# Altium project AD9910.PrjPcb
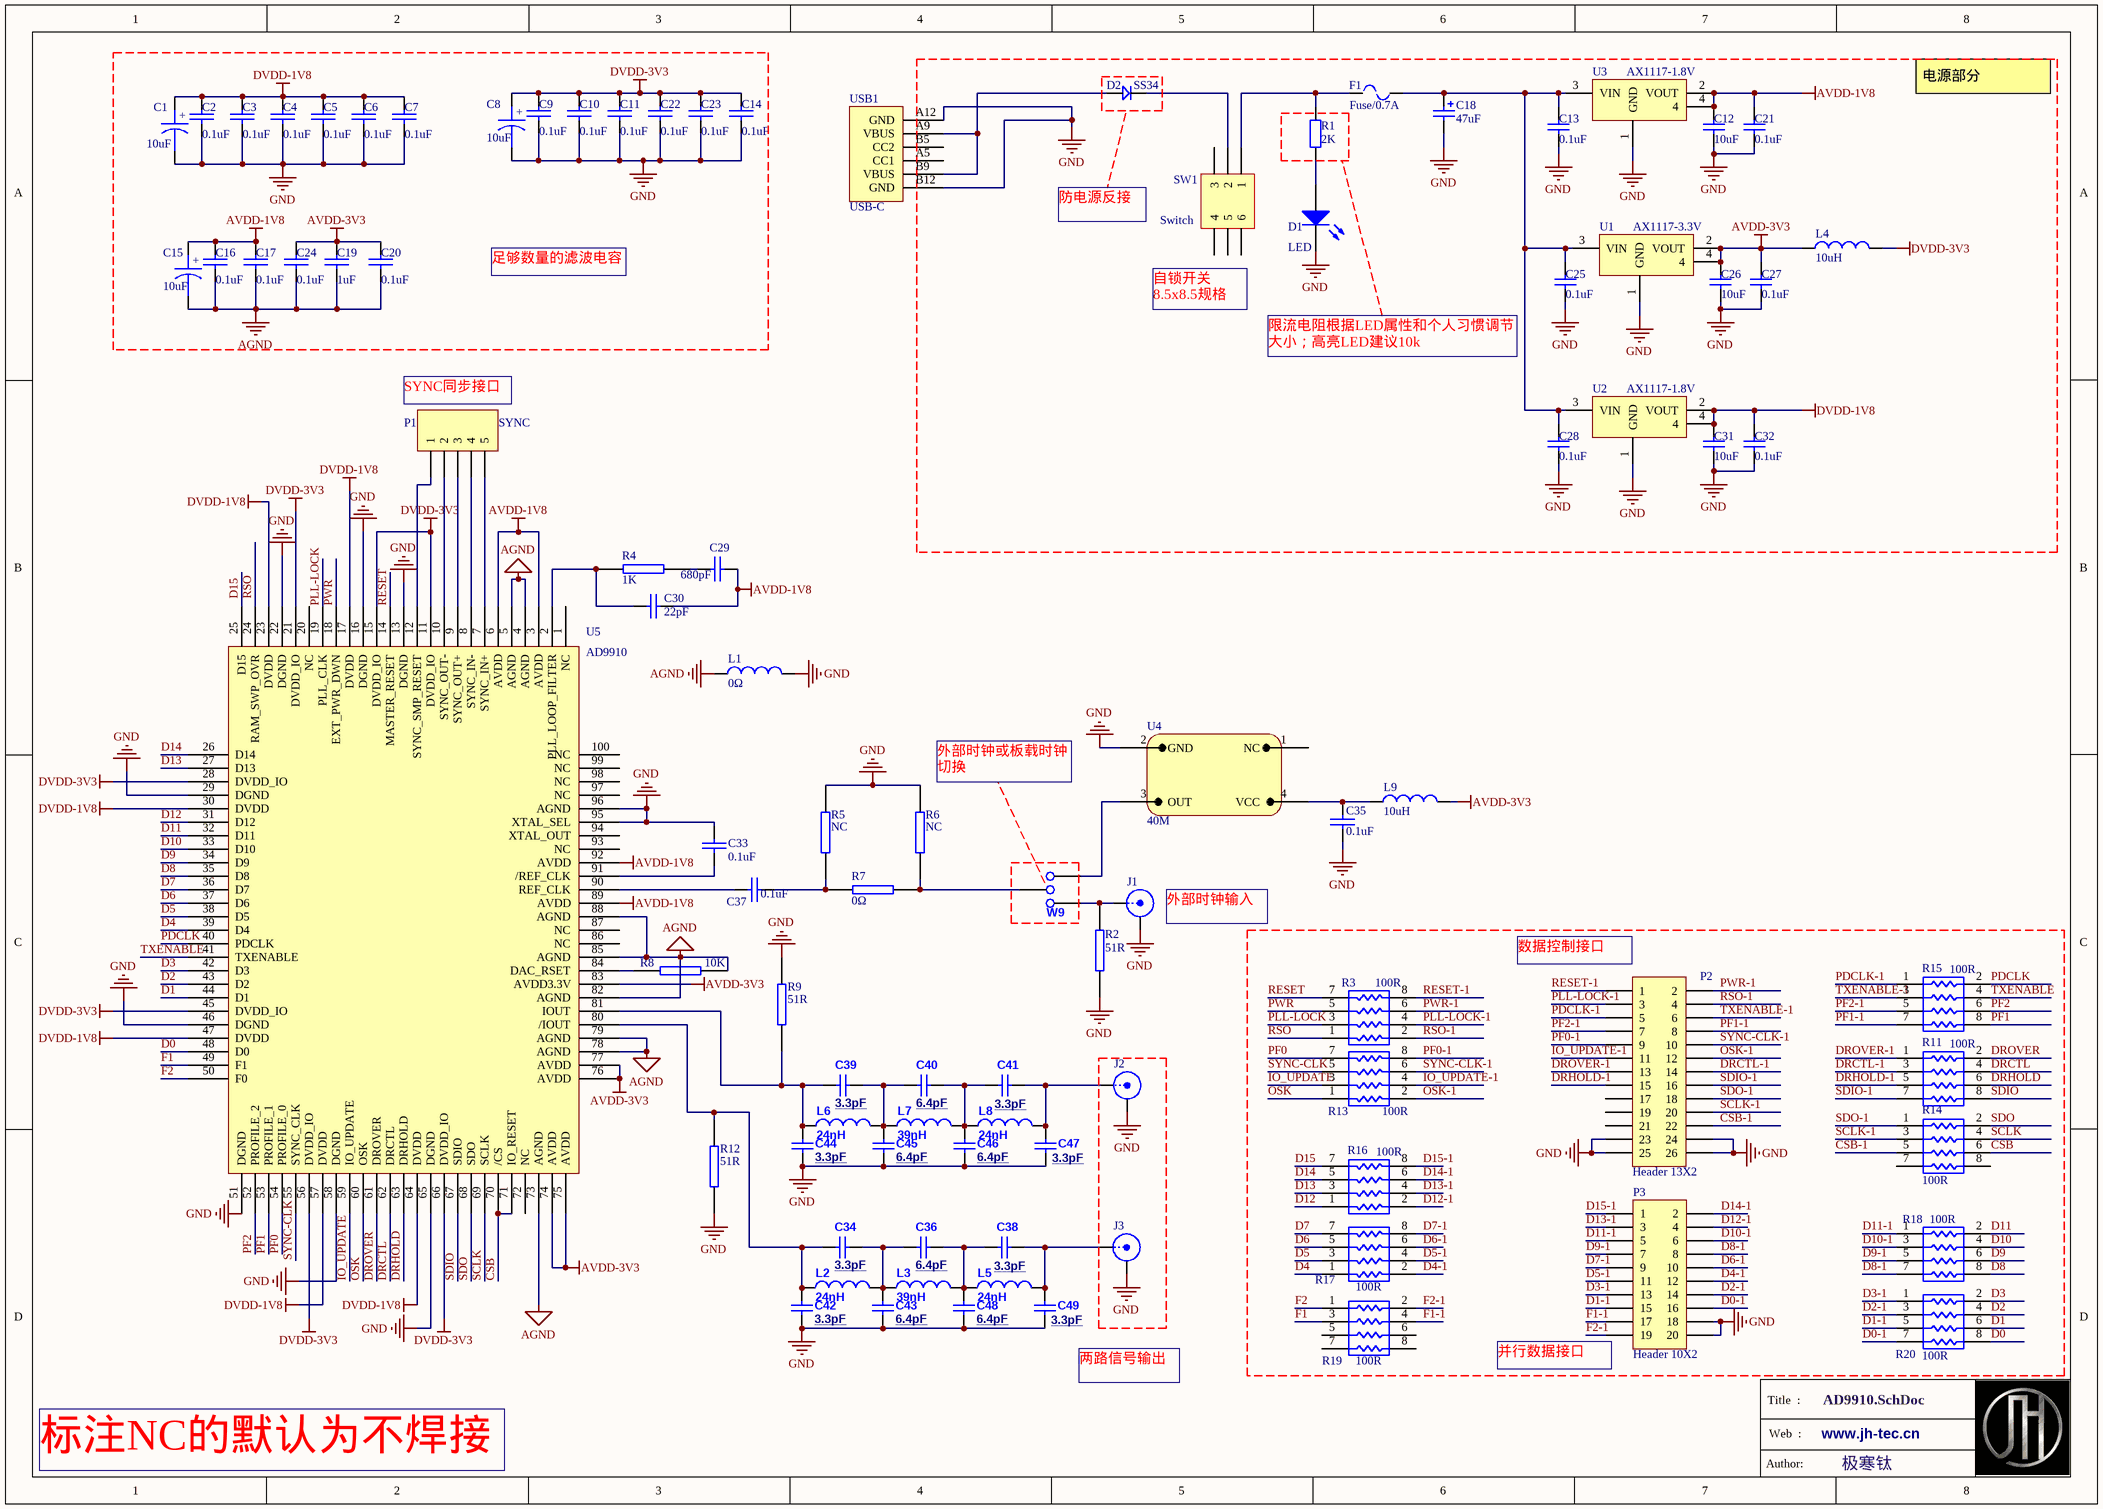
[diagram p0: AD9910.SchDoc]
1 sheet, 94 parts. Net scope: global (net labels, ports and power ports of the same name join across sheets).
Board file: AD9910.PcbDoc

## Sheet AD9910.SchDoc
size A3; DocumentNumber: 1; SheetNumber: 1; SheetTotal: 1

### Parts
C1  10uF  [C3216]
C2  0.1uF  [C0603]
C3  0.1uF  [C0603]
C4  0.1uF  [C0603]
C5  0.1uF  [C0603]
C6  0.1uF  [C0603]
C7  0.1uF  [C0603]
C8  10uF  [C3216]
C9  0.1uF  [C0603]
C10  0.1uF  [C0603]
C11  0.1uF  [C0603]
C12  10uF  [C3216]
C13  0.1uF  [C0603]
C14  0.1uF  [C0603]
C15  10uF  [C3216]
C16  0.1uF  [C0603]
C17  0.1uF  [C0603]
C18  47uF  [C7343]
C19  1uF  [C0603]
C20  0.1uF  [C0603]
C21  0.1uF  [C0603]
C22  0.1uF  [C0603]
C23  0.1uF  [C0603]
C24  0.1uF  [C0603]
C25  0.1uF  [C0603]
C26  10uF  [C3216]
C27  0.1uF  [C0603]
C28  0.1uF  [C0603]
C29  680pF  [C0603]
C30  22pF  [C0603]
C31  10uF  [C3216]
C32  0.1uF  [C0603]
C33  0.1uF  [C0603]
C34  3.3pF  [C0603]
C35  0.1uF  [C0603]
C36  6.4pF  [C0603]
C37  0.1uF  [C0603]
C38  3.3pF  [C0603]
C39  3.3pF  [C0603]
C40  6.4pF  [C0603]
C41  3.3pF  [C0603]
C42  3.3pF  [C0603]
C43  6.4pF  [C0603]
C44  3.3pF  [C0603]
C45  6.4pF  [C0603]
C46  6.4pF  [C0603]
C47  3.3pF  [C0603]
C48  6.4pF  [C0603]
C49  3.3pF  [C0603]
D1  LED  [LED_GREEN_0603]
D2  SS34  [DO-214AC]
F1  Fuse/0.7A  [1812]
J1  SMB  [SMA_RJ45]  (value not drawn)
J2  SMB  [SMA_3D]  (value not drawn)
J3  SMB  [SMA_3D]  (value not drawn)
L1  0Ω  [L0805]
L2  24nH  [L0603]
L3  39nH  [L0603]
L4  10uH  [L0805]
L5  24nH  [L0603]
L6  24nH  [L0603]
L7  39nH  [L0603]
L8  24nH  [L0603]
L9  10uH  [L0805]
P1  SYNC  [HDR1X5]
P2  Header 13X2  [HDR2X13]
P3  Header 10X2  [HDR2X10]
R1  2K  [R0603]
R2  51R  [R0603]
R3  100R  [RA4]
R4  1K  [R0603]
R5  NC  [R0603]
R6  NC  [R0603]
R7  0Ω  [R0603]
R8  10K  [R0603]
R9  51R  [R0603]
R11  100R  [RA4]
R12  51R  [R0603]
R13  100R  [RA4]
R14  100R  [RA4]
R15  100R  [RA4]
R16  100R  [RA4]
R17  100R  [RA4]
R18  100R  [RA4]
R19  100R  [RA4]
R20  100R  [RA4]
SW1  Switch  [SW6_8.5*8.5]
U1  AX1117-3.3V  [SOT-223]
U2  AX1117-1.8V  [SOT-223]
U3  AX1117-1.8V  [SOT-223]
U4  40M  [X7050_4P]
U5  AD9910  [TQFP100]
USB1  USB-C  [USB-C/S_C]
W9  key  [HDR1X3]  (value not drawn)

### Nets
AGND: C15.2 C16.2 C17.2 C19.2 C20.2 C24.2 L1.1 R8.1 U5.4(AGND) U5.5(AGND) U5.73(AGND) U5.78(AGND) U5.79(AGND) U5.82(AGND) U5.85(AGND) U5.88(AGND)
AVDD-1V8: C12.2 C15.1 C16.1 C17.1 C21.1 C29.2 C30.2 U3.2(VOUT) U3.4 U5.3(AVDD) U5.6(AVDD) U5.89(AVDD) U5.92(AVDD)
AVDD-3V3: C19.1 C20.1 C24.1 C26.2 C27.1 L4.1 L9.2 U1.2(VOUT) U1.4 U5.74(AVDD) U5.75(AVDD) U5.76(AVDD) U5.77(AVDD) U5.83(AVDD3.3V)
DVDD-1V8: C1.1 C2.1 C3.1 C4.1 C5.1 C6.1 C7.1 C31.2 C32.1 U2.2(VOUT) U2.4 U5.17(DVDD) U5.23(DVDD) U5.30(DVDD) U5.47(DVDD) U5.57(DVDD) U5.64(DVDD)
DVDD-3V3: C8.1 C9.1 C10.1 C11.1 C14.1 C22.1 C23.1 L4.2 U5.11(DVDD_IO) U5.15(DVDD_IO) U5.21(DVDD_IO) U5.28(DVDD_IO) U5.45(DVDD_IO) U5.56(DVDD_IO) U5.66(DVDD_IO)
GND: C1.2 C2.2 C3.2 C4.2 C5.2 C6.2 C7.2 C8.2 C9.2 C10.2 C11.2 C12.1 C13.2 C14.2 C18.2 C21.2 C22.2 C23.2 C25.2 C26.1 C27.2 C28.2 C31.1 C32.2 C33.2 C35.2 C42.1 C43.1 C44.1 C45.1 C46.1 C47.1 C48.1 C49.1 D1.2 J1.2(Y) J2.2(Y) J3.2(Y) L1.2 P2.23 P2.24 P2.25 P2.26 P3.18 P3.20 R2.2 R5.2 R6.2 R9.2 R12.1 U1.1(GND) U2.1(GND) U3.1(GND) U4.2(GND) U5.13(DGND) U5.16(DGND) U5.22(DGND) U5.29(DGND) U5.46(DGND) U5.51(DGND) U5.58(DGND) U5.65(DGND) U5.95(XTAL_SEL) U5.96(AGND) USB1.A12(GND) USB1.B12(GND)
CSB: R14.6 U5.70(/CS) U5.71(IO_RESET)
CSB-1: P2.22 R14.5
D0: R20.8 U5.48(D0)
D0-1: P3.16 R20.7
D1: R20.6 U5.44(D1)
D1-1: P3.15 R20.5
D2: R20.4 U5.43(D2)
D2-1: P3.14 R20.3
D3: R20.2 U5.42(D3)
D3-1: P3.13 R20.1
D4: R17.1 U5.39(D4)
D4-1: P3.12 R17.2
D5: R17.3 U5.38(D5)
D5-1: P3.11 R17.4
D6: R17.5 U5.37(D6)
D6-1: P3.10 R17.6
D7: R17.7 U5.36(D7)
D7-1: P3.9 R17.8
D8: R18.8 U5.35(D8)
D8-1: P3.8 R18.7
D9: R18.6 U5.34(D9)
D9-1: P3.7 R18.5
D10: R18.4 U5.33(D10)
D10-1: P3.6 R18.3
D11: R18.2 U5.32(D11)
D11-1: P3.5 R18.1
D12: R16.1 U5.31(D12)
D12-1: P3.4 R16.2
D13: R16.3 U5.27(D13)
D13-1: P3.3 R16.4
D14: R16.5 U5.26(D14)
D14-1: P3.2 R16.6
D15: R16.7 U5.25(D15)
D15-1: P3.1 R16.8
DRCTL: R11.4 U5.62(DRCTL)
DRCTL-1: P2.14 R11.3
DRHOLD: R11.6 U5.63(DRHOLD)
DRHOLD-1: P2.15 R11.5
DROVER: R11.2 U5.61(DROVER)
DROVER-1: P2.13 R11.1
F1: R19.3 U5.49(F1)
F1-1: P3.17 R19.4
F2: R19.1 U5.50(F0)
F2-1: P3.19 R19.2
IO_UPDATE: R13.3 U5.59(IO_UPDATE)
IO_UPDATE-1: P2.11 R13.4
OSK: R13.1 U5.60(OSK)
OSK-1: P2.12 R13.2
PDCLK: R15.2 U5.40(PDCLK)
PDCLK-1: P2.5 R15.1
PF0: R13.7 U5.54(PROFILE_0)
PF0-1: P2.9 R13.8
PF1: R15.8 U5.53(PROFILE_1)
PF1-1: P2.8 R15.7
PF2: R15.6 U5.52(PROFILE_2)
PF2-1: P2.7 R15.5
PLL-LOCK: R3.3 U5.19(PLL_CLK)
PLL-LOCK-1: P2.3 R3.4
PWR: R3.5 U5.18(EXT_PWR_DWN)
PWR-1: P2.2 R3.6
RESET: R3.7 U5.14(MASTER_RESET)
RESET-1: P2.1 R3.8
RSO: R3.1 U5.24(RAM_SWP_OVR)
RSO-1: P2.4 R3.2
SCLK: R14.4 U5.69(SCLK)
SCLK-1: P2.20 R14.3
SDIO: R11.8 U5.67(SDIO)
SDIO-1: P2.16 R11.7
SDO: R14.2 U5.68(SDO)
SDO-1: P2.18 R14.1
SYNC-CLK: R13.5 U5.55(SYNC_CLK)
SYNC-CLK-1: P2.10 R13.6
TXENABLE: R15.4 U5.41(TXENABLE)
TXENABLE-1: P2.6 R15.3
NetC13_1: C13.1 C18.1 C25.1 C28.1 F1.2 U1.3(VIN) U2.3(VIN) U3.3(VIN)
NetC29_1: C29.1 R4.1
NetC30_1: C30.1 R4.2 U5.2(PLL_LOOP_FILTER)
NetC33_1: C33.1 U5.91(/REF_CLK)
NetC34_1: C34.1 C42.2 L2.1 R12.2 U5.80(/IOUT)
NetC34_2: C34.2 C36.1 C43.2 L2.2 L3.1
NetC35_1: C35.1 L9.1 U4.4(VCC)
NetC36_2: C36.2 C38.1 C48.2 L3.2 L5.1
NetC37_1: C37.1 U5.90(REF_CLK)
NetC37_2: C37.2 R5.1 R7.2
NetC38_2: C38.2 C49.2 J3.1(X) L5.2
NetC39_1: C39.1 C44.2 L6.1 R9.1 U5.81(IOUT)
NetC39_2: C39.2 C40.1 C45.2 L6.2 L7.1
NetC40_2: C40.2 C41.1 C46.2 L7.2 L8.1
NetC41_2: C41.2 C47.2 J2.1(X) L8.2
NetD1_1: D1.1 R1.1
NetD2_1: D2.1 USB1.A9(VBUS) USB1.B9(VBUS)
NetD2_2: D2.2 SW1.2
NetF1_1: F1.1 R1.2 SW1.1
NetJ1_1: J1.1(X) R2.1 W9.1
NetP1_1: P1.1 U5.12(SYNC_SMP_RESET)
NetP1_2: P1.2 U5.10(SYNC_OUT-)
NetP1_3: P1.3 U5.9(SYNC_OUT+)
NetP1_4: P1.4 U5.8(SYNC_IN-)
NetP1_5: P1.5 U5.7(SYNC_IN+)
NetR6_1: R6.1 R7.1 W9.2
NetR8_2: R8.2 U5.84(DAC_RSET)
NetU4_3: U4.3(OUT) W9.3

Not connected (* = marked no-connect by the designer): P2 17 19 21; R14 7 8; R19 5 6 7 8; SW1 3 4 5 6; U4 1(NC); U5 1(NC) 20(NC) 72(NC) 86(NC) 87(NC) 93(NC) 94(XTAL_OUT) 97(NC) 98(NC) 99(NC) 100(NC); USB1 A5(CC1) B5(CC2)

### Notes on the sheet
- 电源部分
- 防电源反接
- 足够数量的滤波电容
- (near SW1) 自锁开关 8.5x8.5规格
- 限流电阻根据LED属性和个人习惯调节大小；高亮LED建议10k
- (near P1) SYNC同步接口
- (near R6) 外部时钟或板载时钟切换
- (near J1) 外部时钟输入
- (near P2) 数据控制接口
- (near C49) 两路信号输出
- (near P3) 并行数据接口
- 标注NC的默认为不焊接
- Title  :
- Web  :
- www.jh-tec.cn
- Author:
- 极寒钛
- (in symbol CAPACITOR POL) +

### Library data of the parts
C1 C8 C15 = CAPACITOR POL: Capacitor
C2-C7 C9-C11 C14 C16 C17 C19 C20 C22-C24 C29 C30 C33 C35 C37 = CAP: Capacitor
C12 C13 C21 C25-C28 C31 C32 = Cap Semi: Capacitor (Semiconductor SIM Model); Value: 103; Published: 8-Jun-2000; LatestRevisionDate: 29-May-2009; LatestRevisionNote: IPC-7351 Footprint Added.; PackageReference: C1206; Publisher: Altium Limited; PackageDescription: Chip Capacitor
C18 = Cap Pol3_1: Polarized Capacitor (Surface Mount); Value: 100uF; Published: 8-Jun-2000; LatestRevisionDate: 29-May-2009; LatestRevisionNote: IPC-7351 Footprint Added.; PackageReference: C0805; Publisher: Altium Limited; PackageDescription: Chip Capacitor
C34 C39 = Cap: Capacitor; Value: 2.2pF; Published: 8-Jun-2000; LatestRevisionDate: 17-Jul-2002; LatestRevisionNote: Re-released for DXP Platform.; PackageReference: RAD-0.3; Publisher: Altium Limited
C36 C40 = Cap: Capacitor; Value: 12pF; Published: 8-Jun-2000; LatestRevisionDate: 17-Jul-2002; LatestRevisionNote: Re-released for DXP Platform.; PackageReference: RAD-0.3; Publisher: Altium Limited
C38 C41 = Cap: Capacitor; Value: 8.2pF; Published: 8-Jun-2000; LatestRevisionDate: 17-Jul-2002; LatestRevisionNote: Re-released for DXP Platform.; PackageReference: RAD-0.3; Publisher: Altium Limited
C42 C44 = Cap: Capacitor; Value: 27pF; Published: 8-Jun-2000; LatestRevisionDate: 17-Jul-2002; LatestRevisionNote: Re-released for DXP Platform.; PackageReference: RAD-0.3; Publisher: Altium Limited
C43 C45 = Cap: Capacitor; Value: 47pF; Published: 8-Jun-2000; LatestRevisionDate: 17-Jul-2002; LatestRevisionNote: Re-released for DXP Platform.; PackageReference: RAD-0.3; Publisher: Altium Limited
C46 C48 = Cap: Capacitor; Value: 39pF; Published: 8-Jun-2000; LatestRevisionDate: 17-Jul-2002; LatestRevisionNote: Re-released for DXP Platform.; PackageReference: RAD-0.3; Publisher: Altium Limited
C47 C49 = Cap: Capacitor; Value: 22pF; Published: 8-Jun-2000; LatestRevisionDate: 17-Jul-2002; LatestRevisionNote: Re-released for DXP Platform.; PackageReference: RAD-0.3; Publisher: Altium Limited
D2 = D: 1N4148
F1 = Fuse
J1-J3 = SMB: SMB Straight Connector; LatestRevisionDate: 17-Jul-2002; LatestRevisionNote: Re-released for DXP Platform.; Publisher: Altium Limited
L1 = Inductor: Code_IEC: 1005; Value: 10uH; Published: 8-Jun-2000; LatestRevisionDate: 29-May-2009; LatestRevisionNote: IPC-7351 Footprint Added.; PackageReference: 0402-A; Publisher: Altium Limited; PackageDescription: Chip Inductor; Code_JEITA: 0402
L2 L3 L5-L8 = Inductor: Code_IEC: 1005; Value: 82nH; Published: 8-Jun-2000; LatestRevisionDate: 17-Jul-2002; LatestRevisionNote: Re-released for DXP Platform.; PackageReference: 0402-A; Publisher: Altium Limited; Code_JEITA: 0402
L4 L9 = Inductor: Code_IEC: 1005; Published: 8-Jun-2000; LatestRevisionDate: 29-May-2009; LatestRevisionNote: IPC-7351 Footprint Added.; PackageReference: 0402-A; Publisher: Altium Limited; PackageDescription: Chip Inductor; Code_JEITA: 0402; Value: 10uH
P1 = Header 5: Header, 5-Pin; LatestRevisionDate: 17-Jul-2002; LatestRevisionNote: Re-released for DXP Platform.; Publisher: Altium Limited
P2 = Header 13X2: Header, 13-Pin, Dual row; LatestRevisionDate: 17-Jul-2002; LatestRevisionNote: Re-released for DXP Platform.; Publisher: Altium Limited
P3 = Header 10X2: Header, 10-Pin, Dual row; LatestRevisionDate: 17-Jul-2002; LatestRevisionNote: Re-released for DXP Platform.; Publisher: Altium Limited
R1 = Res2: Resistor; Value: 1K; Published: 8-Jun-2000; LatestRevisionDate: 17-Jul-2002; LatestRevisionNote: Re-released for DXP Platform.; PackageReference: AXIAL-0.4; Publisher: Altium Limited; PackageDescription: Axial Device, Thru-Hole; 2 Leads; 0.4 in Pin Spacing
R2 R4-R9 R12 = RES2
R3 R11 R13-R20 = RESPACK1
SW1 = SW6
U1-U3 = AMS1117
U4 = CRYS2
USB1 = USB-C_6P/S: USB-C_6P型母接口; BOM名称: USB-C型母接口
W9 = W: KEY 1 to 2
D1 = LED: Published: 8-Jun-2000; LatestRevisionDate: 08-Jul-2005; LatestRevisionNote: Mech Layer 1 removed.; PackageReference: LED-0; Publisher: Altium Limited; PackageDescription: LED; 2 Leads